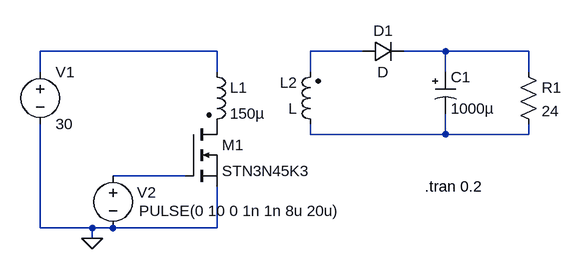
[diagram p0: schematic Draft1.asc]
Draft1.asc, the LTspice schematic file:
Version 4
SHEET 1 904 680
WIRE 256 -48 -16 -48
WIRE 480 -48 400 -48
WIRE 608 -48 544 -48
WIRE 736 -48 608 -48
WIRE -16 -16 -16 -48
WIRE 256 -16 256 -48
WIRE 400 -16 400 -48
WIRE 608 -16 608 -48
WIRE 736 -16 736 -48
WIRE 400 80 400 64
WIRE 608 80 608 48
WIRE 608 80 400 80
WIRE 736 80 736 64
WIRE 736 80 608 80
WIRE 208 144 96 144
WIRE -16 224 -16 64
WIRE 64 224 -16 224
WIRE 96 224 64 224
WIRE 256 224 256 160
WIRE 256 224 96 224
WIRE 64 240 64 224
FLAG 64 240 0
SYMBOL voltage -16 -32 R0
WINDOW 123 0 0 Left 0
WINDOW 39 0 0 Left 0
SYMATTR InstName V1
SYMATTR Value 30
SYMBOL voltage 96 128 R0
WINDOW 0 37 41 Left 2
WINDOW 3 40 70 Left 2
WINDOW 123 0 0 Left 0
WINDOW 39 0 0 Left 0
SYMATTR InstName V2
SYMATTR Value PULSE(0 10 0 1n 1n 8u 20u)
SYMBOL ind2 240 -32 R0
SYMATTR InstName L1
SYMATTR Value 150µ
SYMATTR Type ind
SYMBOL ind2 416 80 R180
WINDOW 0 36 80 Left 2
WINDOW 3 36 40 Left 2
SYMATTR InstName L2
SYMATTR Type ind
SYMBOL nmos 208 64 R0
SYMATTR InstName M1
SYMATTR Value STN3N45K3
SYMBOL diode 480 -32 R270
WINDOW 0 32 32 VTop 2
WINDOW 3 0 32 VBottom 2
SYMATTR InstName D1
SYMBOL polcap 592 -16 R0
SYMATTR InstName C1
SYMATTR Value 1000µ
SYMBOL res 720 -32 R0
SYMATTR InstName R1
SYMATTR Value 24
TEXT 576 160 Left 2 !.tran 0.2

The netlist it stands for:
* Draft1.asc
V1 N001 0 30
V2 N005 0 PULSE(0 10 0 1n 1n 8u 20u)
L1 N001 P001 150µ
L2 N004 N002 L
M1 P001 N005 0 0 STN3N45K3
D1 N002 N003 D
C1 N003 N004 1000µ
R1 N003 N004 24
.model D D
.lib standard.dio
.model NMOS NMOS
.model PMOS PMOS
.lib standard.mos
.tran 0.2
.backanno
.end